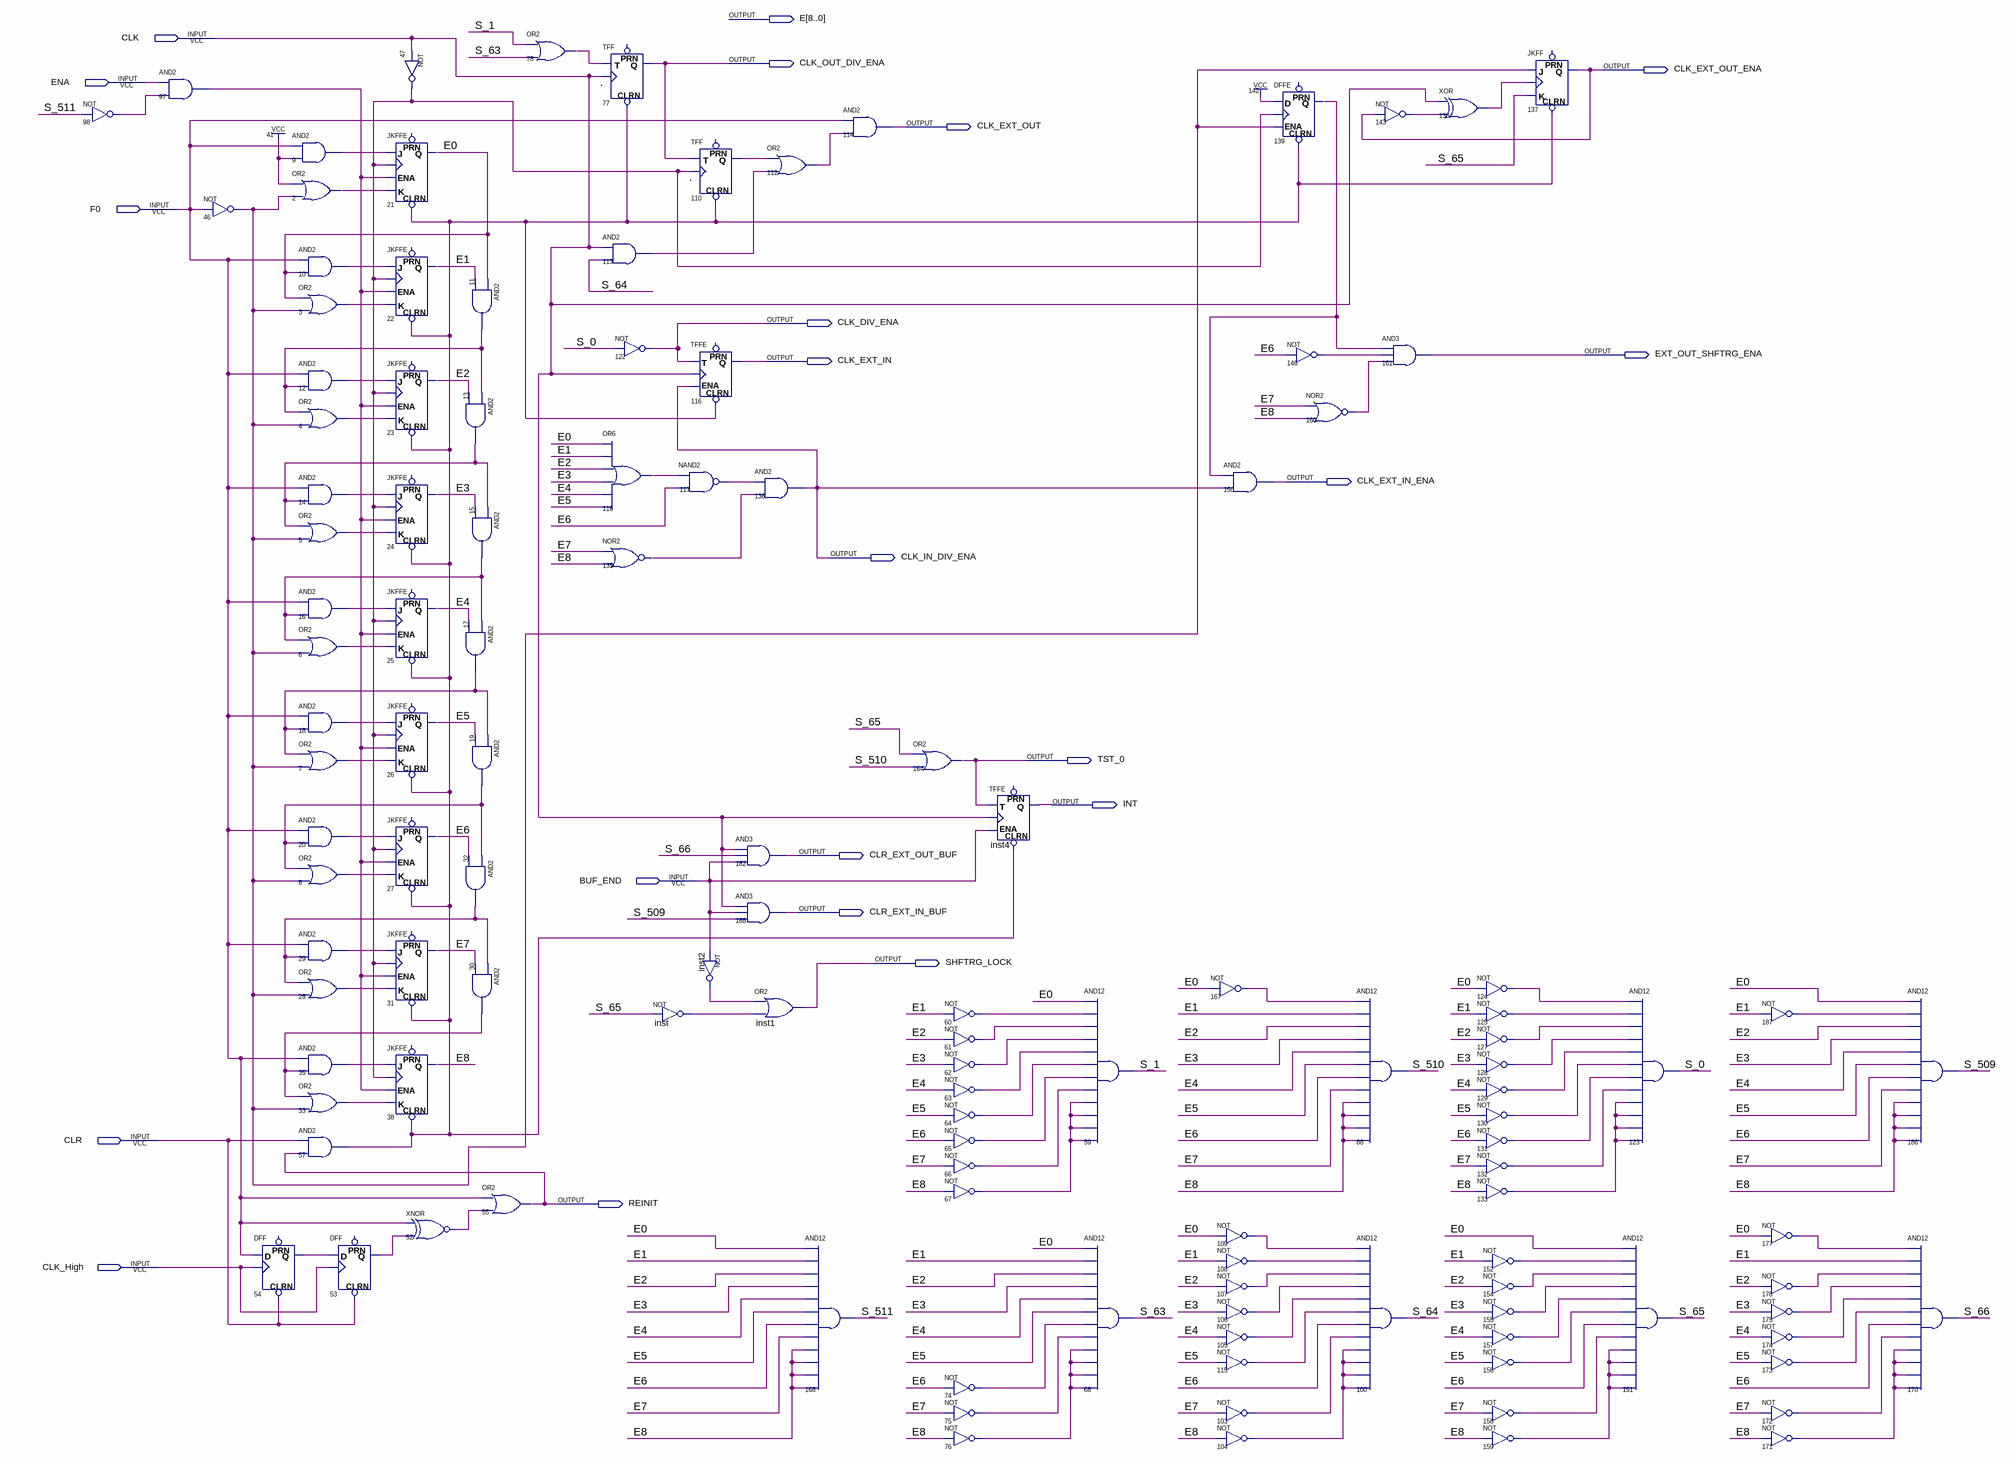
[diagram p0: schematic sheet]
// Quartus schematic shrg_ctrl9.bdf as structural Verilog: 123 symbols, 21 pins
module shrg_ctrl9 (
  input  CLK,
  input  ENA,
  input  F0,
  input  BUF_END,
  input  CLR,
  input  CLK_High,
  output [8:0] E,
  output CLK_OUT_DIV_ENA,
  output CLK_EXT_OUT_ENA,
  output CLK_EXT_OUT,
  output CLK_DIV_ENA,
  output EXT_OUT_SHFTRG_ENA,
  output CLK_EXT_IN,
  output CLK_EXT_IN_ENA,
  output CLK_IN_DIV_ENA,
  output TST_0,
  output INT,
  output CLR_EXT_OUT_BUF,
  output CLR_EXT_IN_BUF,
  output SHFTRG_LOCK,
  output REINIT
);

  wire inst2_out, inst_out, n2_out, n3_out, n4_out, n5_out, n6_out, n7_out, n8_out, n9_out, n10_out, n11_out,
       n12_out, n13_out, n14_out, n15_out, n16_out, n17_out, n18_out, n19_out, n20_out, n28_out, n29_out,
       n30_out, n32_out, n33_out, n35_out, n46_out, n47_out, n52_out, n53_q, n54_q, n57_out, n60_out,
       n61_out, n62_out, n63_out, n64_out, n65_out, n66_out, n67_out, n74_out, n75_out, n76_out, n78_out,
       n97_out, n98_out, n103_out, n104_out, n105_out, n106_out, n107_out, n108_out, n109_out, n110_q,
       n112_out, n113_out, n115_out, n117_out, n118_out, n124_out, n125_out, n127_out, n128_out, n129_out,
       n130_out, n131_out, n132_out, n133_out, n135_out, n138_out, n139_q, n143_out, n146_out, n152_out,
       n154_out, n155_out, n156_out, n157_out, n158_out, n159_out, n160_out, n167_out, n171_out, n172_out,
       n173_out, n174_out, n175_out, n176_out, n177_out, n187_out, S_0, S_1, S_63, S_64, S_65, S_66, S_509,
       S_510, S_511;

  not u_98 (n98_out, S_511);
  and u_97 (n97_out, ENA, n98_out);
  not u_46 (n46_out, F0);
  DFF u_54 (.CLRN(CLR), .CLK(CLK_High), .D(F0), .Q(n54_q));  // open: PRN
  and u_9 (n9_out, F0, 1'b1);
  or u_2 (n2_out, 1'b1, n46_out);
  and u_10 (n10_out, F0, E[0]);
  or u_3 (n3_out, E[0], n46_out);
  and u_12 (n12_out, F0, n11_out);
  or u_4 (n4_out, n11_out, n46_out);
  and u_14 (n14_out, F0, n13_out);
  or u_5 (n5_out, n13_out, n46_out);
  and u_16 (n16_out, F0, n15_out);
  or u_6 (n6_out, n15_out, n46_out);
  and u_18 (n18_out, F0, n17_out);
  or u_7 (n7_out, n17_out, n46_out);
  and u_20 (n20_out, F0, n19_out);
  or u_8 (n8_out, n19_out, n46_out);
  and u_29 (n29_out, F0, n32_out);
  or u_28 (n28_out, n32_out, n46_out);
  and u_35 (n35_out, F0, n30_out);
  or u_33 (n33_out, n30_out, n46_out);
  and u_57 (n57_out, CLR, REINIT);
  DFF u_53 (.CLRN(CLR), .CLK(CLK_High), .D(n54_q), .Q(n53_q));  // open: PRN
  not u_47 (n47_out, CLK);
  JKFFE u_21 (.J(n9_out), .CLK(n47_out), .CLRN(n57_out), .K(n2_out), .ENA(n97_out), .Q(E[0]));  // open: PRN
  JKFFE u_22 (.J(n10_out), .CLK(n47_out), .CLRN(n57_out), .K(n3_out), .ENA(n97_out), .Q(E[1]));  // open: PRN
  JKFFE u_23 (.J(n12_out), .CLK(n47_out), .CLRN(n57_out), .K(n4_out), .ENA(n97_out), .Q(E[2]));  // open: PRN
  JKFFE u_24 (.J(n14_out), .CLK(n47_out), .CLRN(n57_out), .K(n5_out), .ENA(n97_out), .Q(E[3]));  // open: PRN
  JKFFE u_25 (.J(n16_out), .CLK(n47_out), .CLRN(n57_out), .K(n6_out), .ENA(n97_out), .Q(E[4]));  // open: PRN
  JKFFE u_26 (.J(n18_out), .CLK(n47_out), .CLRN(n57_out), .K(n7_out), .ENA(n97_out), .Q(E[5]));  // open: PRN
  JKFFE u_27 (.J(n20_out), .CLK(n47_out), .CLRN(n57_out), .K(n8_out), .ENA(n97_out), .Q(E[6]));  // open: PRN
  JKFFE u_31 (.J(n29_out), .CLK(n47_out), .CLRN(n57_out), .K(n28_out), .ENA(n97_out), .Q(E[7]));  // open: PRN
  JKFFE u_38 (.J(n35_out), .CLK(n47_out), .CLRN(n57_out), .K(n33_out), .ENA(n97_out), .Q(E[8]));  // open: PRN
  xnor u_52 (n52_out, F0, n53_q);
  and u_13 (n13_out, n11_out, E[2]);
  and u_17 (n17_out, n15_out, E[4]);
  and u_32 (n32_out, n19_out, E[6]);
  and u_11 (n11_out, E[0], E[1]);
  and u_15 (n15_out, n13_out, E[3]);
  and u_19 (n19_out, n17_out, E[5]);
  and u_30 (n30_out, n32_out, E[7]);
  or u_55 (REINIT, F0, n52_out);
  or u_78 (n78_out, S_1, S_63);
  TFF u_77 (.CLRN(n57_out), .T(n78_out), .CLK(CLK), .Q(CLK_OUT_DIV_ENA));  // open: PRN
  and u_113 (n113_out, CLK, S_64);
  not u_122 (CLK_DIV_ENA, S_0);
  or u_118 (n118_out, E[0], E[1], E[2], E[3], E[4], E[5]);
  nor u_135 (n135_out, E[7], E[8]);
  not inst (inst_out, S_65);
  TFF u_110 (.CLRN(n57_out), .T(CLK_OUT_DIV_ENA), .CLK(n47_out), .Q(n110_q));  // open: PRN
  TFFE u_116 (.CLRN(n57_out), .T(CLK_DIV_ENA), .CLK(CLK), .ENA(CLK_IN_DIV_ENA), .Q(CLK_EXT_IN));  // open: PRN
  nand u_117 (n117_out, n118_out, E[6]);
  not inst2 (inst2_out, BUF_END);
  or u_112 (n112_out, n110_q, n113_out);
  and u_136 (CLK_IN_DIV_ENA, n117_out, n135_out);
  and u_182 (CLR_EXT_OUT_BUF, CLK, S_66, BUF_END);
  and u_188 (CLR_EXT_IN_BUF, CLK, BUF_END, S_509);
  or inst1 (SHFTRG_LOCK, inst2_out, inst_out);
  and u_168 (S_511, E[0], E[1], E[2], E[3], E[4], E[5], E[6], E[7], E[8], E[8], E[8], E[8]);
  and u_114 (CLK_EXT_OUT, F0, n112_out);
  or u_164 (TST_0, S_65, S_510);
  not u_60 (n60_out, E[1]);
  not u_61 (n61_out, E[2]);
  not u_62 (n62_out, E[3]);
  not u_63 (n63_out, E[4]);
  not u_64 (n64_out, E[5]);
  not u_65 (n65_out, E[6]);
  not u_66 (n66_out, E[7]);
  not u_67 (n67_out, E[8]);
  not u_74 (n74_out, E[6]);
  not u_75 (n75_out, E[7]);
  not u_76 (n76_out, E[8]);
  TFFE inst4 (.CLRN(n57_out), .T(TST_0), .CLK(CLK), .ENA(BUF_END), .Q(INT));  // open: PRN
  and u_59 (S_1, E[0], n60_out, n61_out, n62_out, n63_out, n64_out, n65_out, n66_out, n67_out, n67_out, n67_out, n67_out);
  and u_68 (S_63, E[0], E[1], E[2], E[3], E[4], E[5], n74_out, n75_out, n76_out, n76_out, n76_out, n76_out);
  and u_150 (CLK_EXT_IN_ENA, n139_q, CLK_IN_DIV_ENA);
  not u_167 (n167_out, E[0]);
  not u_109 (n109_out, E[0]);
  not u_108 (n108_out, E[1]);
  not u_107 (n107_out, E[2]);
  not u_106 (n106_out, E[3]);
  not u_105 (n105_out, E[4]);
  not u_115 (n115_out, E[5]);
  not u_103 (n103_out, E[7]);
  not u_104 (n104_out, E[8]);
  DFFE u_139 (.CLRN(n57_out), .D(1'b1), .CLK(n47_out), .ENA(n46_out), .Q(n139_q));  // open: PRN
  not u_146 (n146_out, E[6]);
  nor u_160 (n160_out, E[7], E[8]);
  not u_143 (n143_out, CLK_EXT_OUT_ENA);
  and u_88 (S_510, n167_out, E[1], E[2], E[3], E[4], E[5], E[6], E[7], E[8], E[8], E[8], E[8]);
  and u_100 (S_64, n109_out, n108_out, n107_out, n106_out, n105_out, n115_out, E[6], n103_out, n104_out, n104_out, n104_out, n104_out);
  and u_161 (EXT_OUT_SHFTRG_ENA, n139_q, n146_out, n160_out);
  xor u_138 (n138_out, CLK, n143_out);
  not u_124 (n124_out, E[0]);
  not u_125 (n125_out, E[1]);
  not u_127 (n127_out, E[2]);
  not u_128 (n128_out, E[3]);
  not u_129 (n129_out, E[4]);
  not u_130 (n130_out, E[5]);
  not u_131 (n131_out, E[6]);
  not u_132 (n132_out, E[7]);
  not u_133 (n133_out, E[8]);
  JKFF u_137 (.CLRN(n57_out), .K(S_65), .J(n46_out), .CLK(n138_out), .Q(CLK_EXT_OUT_ENA));  // open: PRN
  not u_152 (n152_out, E[1]);
  not u_154 (n154_out, E[2]);
  not u_155 (n155_out, E[3]);
  not u_157 (n157_out, E[4]);
  not u_156 (n156_out, E[5]);
  not u_158 (n158_out, E[7]);
  not u_159 (n159_out, E[8]);
  and u_123 (S_0, n124_out, n125_out, n127_out, n128_out, n129_out, n130_out, n131_out, n132_out, n133_out, n133_out, n133_out, n133_out);
  and u_151 (S_65, E[0], n152_out, n154_out, n155_out, n157_out, n156_out, E[6], n158_out, n159_out, n159_out, n159_out, n159_out);
  not u_187 (n187_out, E[1]);
  not u_177 (n177_out, E[0]);
  not u_176 (n176_out, E[2]);
  not u_175 (n175_out, E[3]);
  not u_174 (n174_out, E[4]);
  not u_173 (n173_out, E[5]);
  not u_172 (n172_out, E[7]);
  not u_171 (n171_out, E[8]);
  and u_186 (S_509, E[0], n187_out, E[2], E[3], E[4], E[5], E[6], E[7], E[8], E[8], E[8], E[8]);
  and u_170 (S_66, n177_out, E[1], n176_out, n175_out, n174_out, n173_out, E[6], n172_out, n171_out, n171_out, n171_out, n171_out);
endmodule
